# Altium schematic sheet FPGA_POWER.SchDoc
size 420 x 297 mm; SheetNumber: 27; SheetTotal: 34
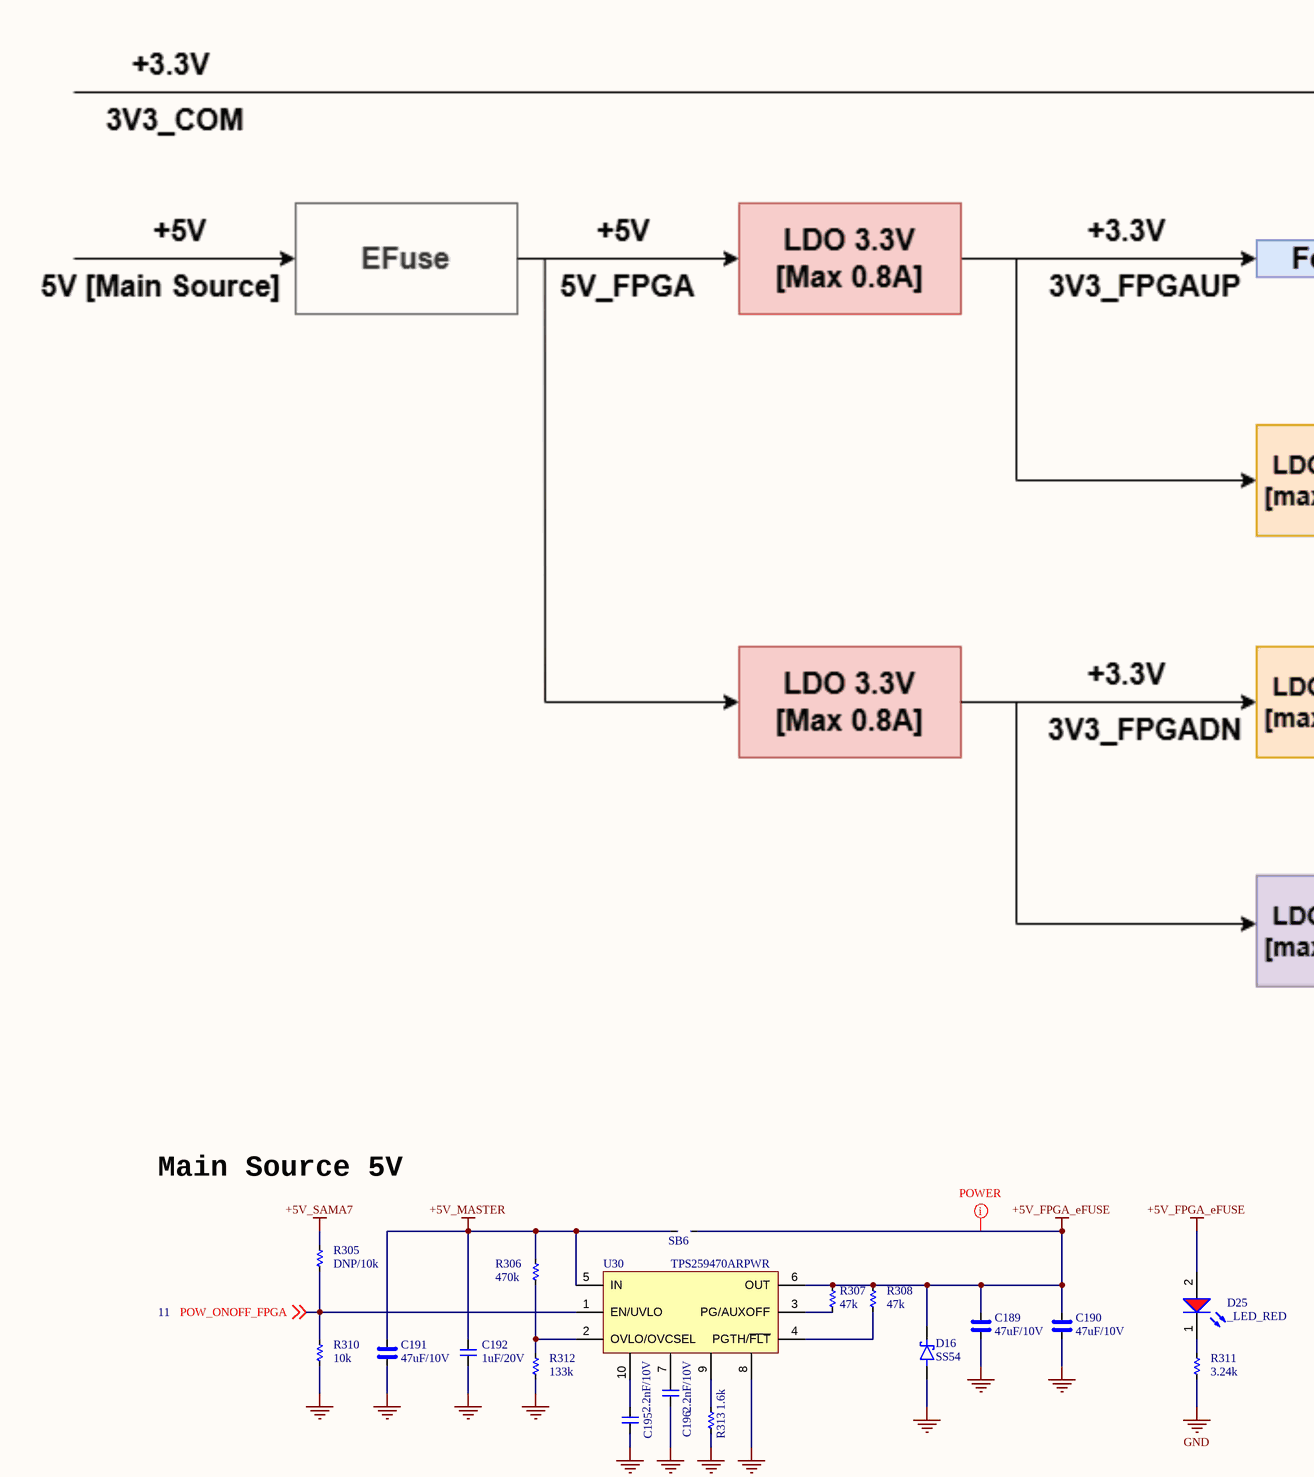
[diagram p0: FPGA_POWER.SchDoc, top left]
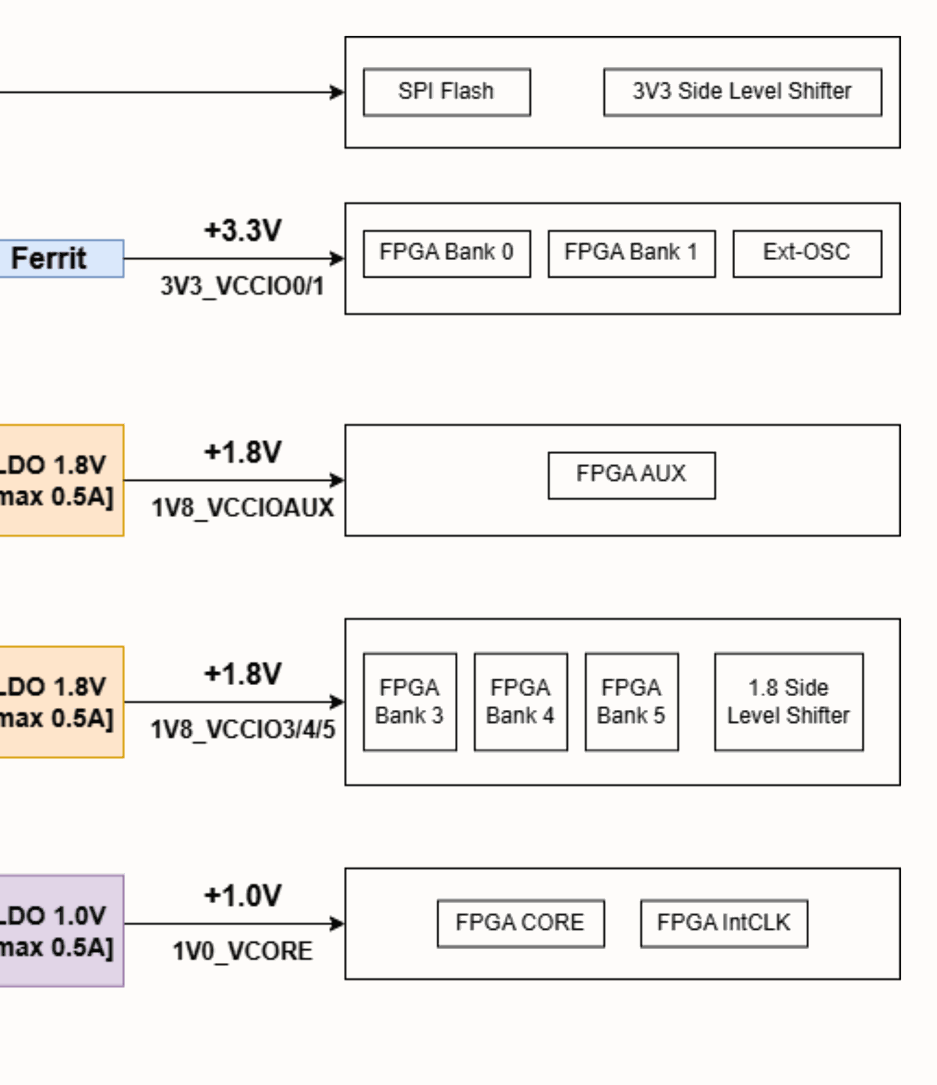
[diagram p1: FPGA_POWER.SchDoc, top right]
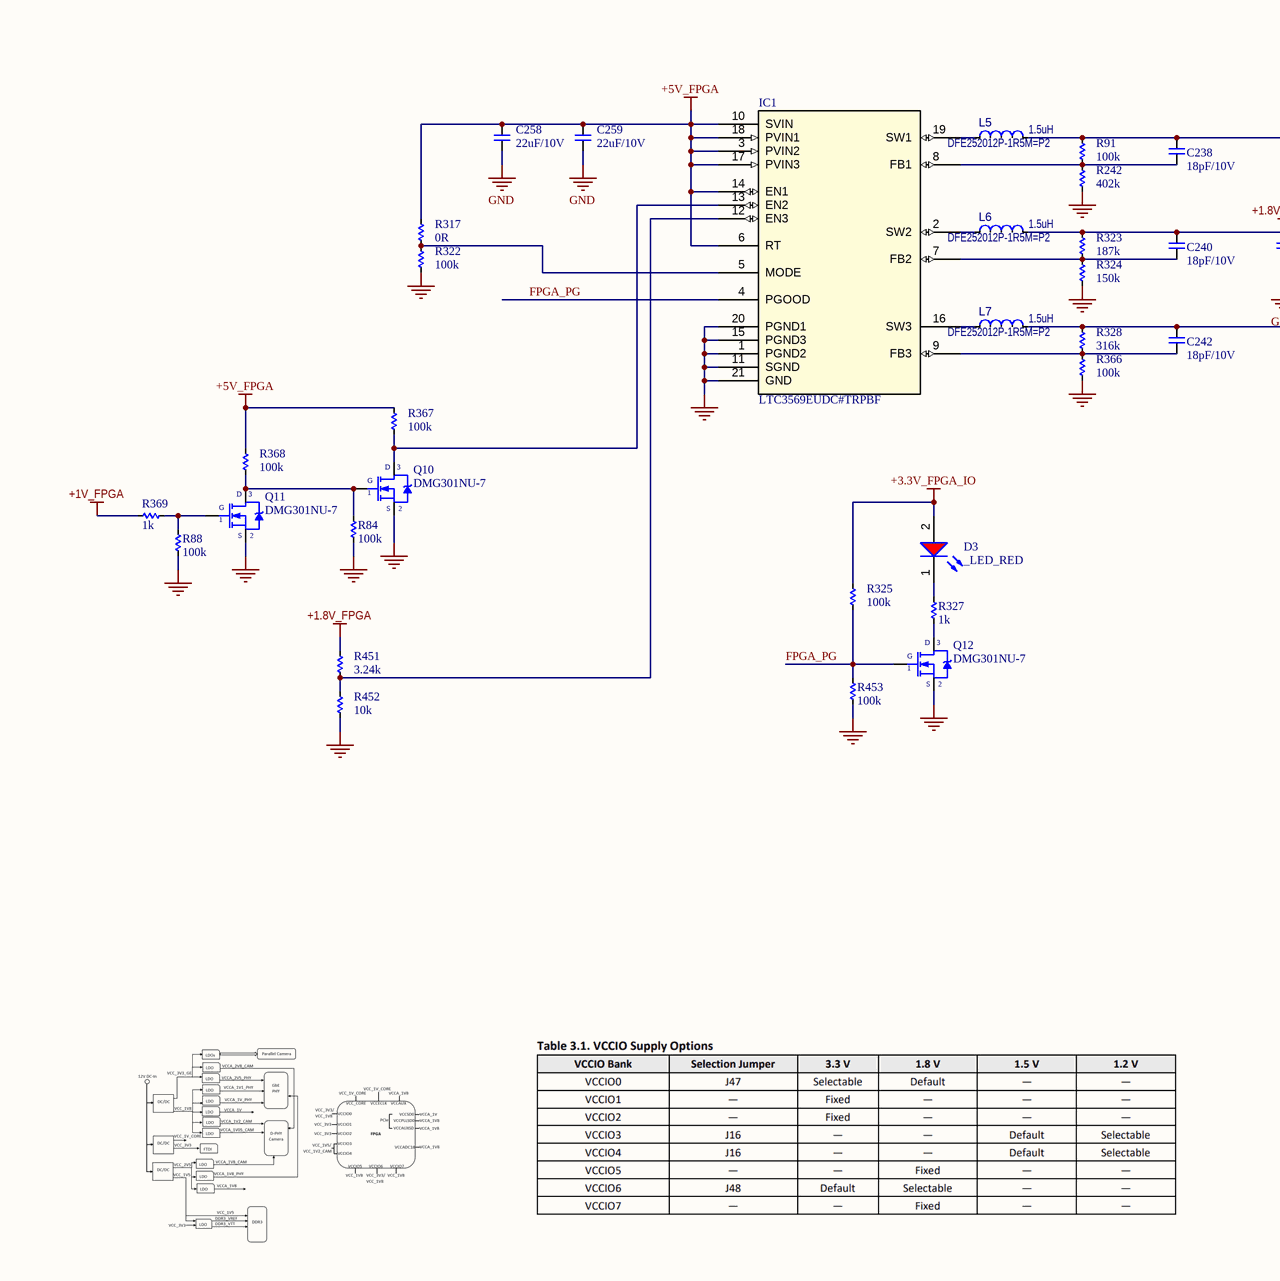
[diagram p2: FPGA_POWER.SchDoc, bottom left]
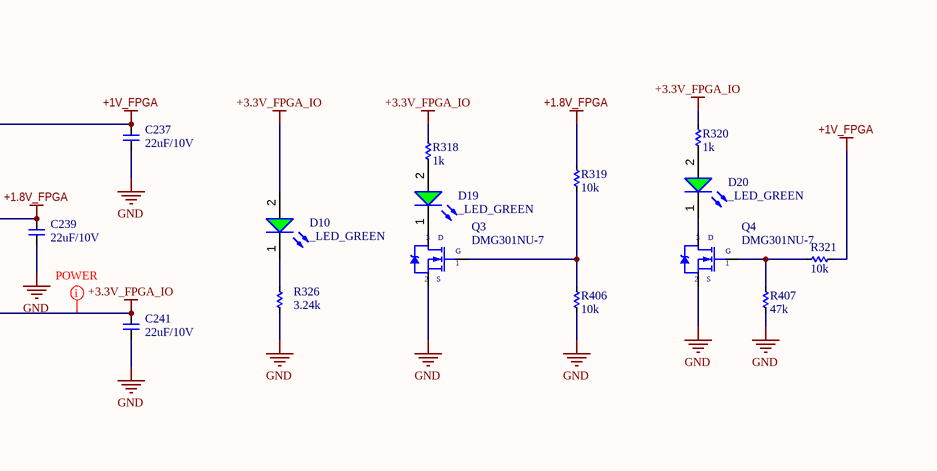
[diagram p3: FPGA_POWER.SchDoc, bottom right]

## Parts
C189  47uF/10V  [CAP_C_3225X80]
C190  47uF/10V  [CAP_C_3225X80]
C191  47uF/10V  [CAP_C_3225X80]
C192  1uF/20V  [CAP_C_1005X50_L]
C195  2.2nF/10V  [CAP_C_1005X50_L]
C196  2.2nF/10V  [CAP_C_1005X50_L]
C237  22uF/10V  [CAP_C_1608X80]
C238  18pF/10V  [CAP_C_1005X50_L]
C239  22uF/10V  [CAP_C_1608X80]
C240  18pF/10V  [CAP_C_1005X50_L]
C241  22uF/10V  [CAP_C_1608X80]
C242  18pF/10V  [CAP_C_1005X50_L]
C258  22uF/10V  [CAP_C_1608X80]
C259  22uF/10V  [CAP_C_1608X80]
D3  _LED_RED  [LED_0603]
D10  _LED_GREEN  [LED_0603]
D16  SS54  [DO-214AC_SMA]
D19  _LED_GREEN  [LED_0603]
D20  _LED_GREEN  [LED_0603]
D25  _LED_RED  [LED_0603]
IC1  LTC3569EUDC#TRPBF  [QFN20_UDC_3X4_ADI]
L5  value 1.5uH  [IND_C_1008]  (hidden comment: DFE252012P-1R5M=P2)
L6  value 1.5uH  [IND_C_1008]  (hidden comment: DFE252012P-1R5M=P2)
L7  value 1.5uH  [IND_C_1008]  (hidden comment: DFE252012P-1R5M=P2)
Q3  DMG301NU-7  [SOT95P240X120-3N]
Q4  DMG301NU-7  [SOT95P240X120-3N]
Q10  DMG301NU-7  [SOT95P240X120-3N]
Q11  DMG301NU-7  [SOT95P240X120-3N]
Q12  DMG301NU-7  [SOT95P240X120-3N]
R84  100k  [RES_C_1005x30_L]
R88  100k  [RES_C_1005x30_L]
R91  100k  [RES_C_1005x30_L]
R242  402k  [RES_C_1005x30_L]
R305  DNP/10k  [RES_C_1005x30_L]
R306  470k  [RES_C_1005x30_L]
R307  47k  [RES_C_1005x30_L]
R308  47k  [RES_C_1005x30_L]
R310  10k  [RES_C_1005x30_L]
R311  3.24k  [RES_C_1005x30_L]
R312  133k  [RES_C_1005x30_L]
R313  1.6k  [RES_C_1005x30_L]
R317  0R  [RES_C_1005x30_L]
R318  1k  [RES_C_1005x30_L]
R319  10k  [RES_C_1005x30_L]
R320  1k  [RES_C_1005x30_L]
R321  10k  [RES_C_1005x30_L]
R322  100k  [RES_C_1005x30_L]
R323  187k  [RES_C_1005x30_L]
R324  150k  [RES_C_1005x30_L]
R325  100k  [RES_C_1005x30_L]
R326  3.24k  [RES_C_1005x30_L]
R327  1k  [RES_C_1005x30_L]
R328  316k  [RES_C_1005x30_L]
R366  100k  [RES_C_1005x30_L]
R367  100k  [RES_C_1005x30_L]
R368  100k  [RES_C_1005x30_L]
R369  1k  [RES_C_1005x30_L]
R406  10k  [RES_C_1005x30_L]
R407  47k  [RES_C_1005x30_L]
R451  3.24k  [RES_C_1005x30_L]
R452  10k  [RES_C_1005x30_L]
R453  100k  [RES_C_1005x30_L]
SB6  JUMPER  [JUMPER_1608]  (value not drawn)
U30  TPS259470ARPWR  [VQFN-HR-10]

## Nets
+1.8V_FPGA: C239.1 C240.1 L6.2(F) R319.1 R323.2 R451.2
+1V_FPGA: C237.1 C238.1 L5.2(F) R91.2 R321.1 R369.2
+3.3V_FPGA_IO: C241.1 C242.1 D3.2(A) D10.2(A) L7.2(F) R318.2 R320.2 R325.2 R328.2
+5V_FPGA: C258.1 C259.1 IC1.3(PVIN2) IC1.6(RT) IC1.10(SVIN) IC1.14(EN1) IC1.17(PVIN3) IC1.18(PVIN1) R317.2 R367.2 R368.2
+5V_FPGA_eFUSE: C189.2 C190.2 D16.1(K) D25.2(A) R307.2 R308.2 SB6.2 U30.6(OUT)
+5V_MASTER: C191.2 C192.2 R306.2 SB6.1 U30.5(IN)
+5V_SAMA7: R305.1
GND: C189.1 C190.1 C191.1 C192.1 C195.1 C196.1 C237.2 C239.2 C241.2 C258.2 C259.2 D16.2(A) IC1.1(PGND2) IC1.11(SGND) IC1.15(PGND3) IC1.20(PGND1) IC1.21(GND) Q3.2(S) Q4.2(S) Q10.2(S) Q11.2(S) Q12.2(S) R84.2 R88.2 R242.1 R310.2 R311.1 R312.1 R313.1 R322.1 R324.1 R326.1 R366.1 R406.2 R407.1 R452.1 R453.2 U30.8
FPGA_PG: IC1.4(PGOOD) Q12.1(G) R325.1 R453.1
POW_ONOFF_FPGA: R305.2 R310.1 U30.1(EN/UVLO) ; off-sheet POW_ONOFF_FPGA
NetC195_2: C195.2 U30.10
NetC196_2: C196.2 U30.7
NetC238_2: C238.2 IC1.8(FB1) R91.1 R242.2
NetC240_2: C240.2 IC1.7(FB2) R323.1 R324.2
NetC242_2: C242.2 IC1.9(FB3) R328.1 R366.2
NetD3_1: D3.1(K) R327.2
NetD10_1: D10.1(K) R326.2
NetD19_1: D19.1(K) Q3.3(D)
NetD19_2: D19.2(A) R318.1
NetD20_1: D20.1(K) Q4.3(D)
NetD20_2: D20.2(A) R320.1
NetD25_1: D25.1(K) R311.2
NetIC1_2: IC1.2(SW2) L6.1(S)
NetIC1_5: IC1.5(MODE) R317.1 R322.2
NetIC1_12: IC1.12(EN3) R451.1 R452.2
NetIC1_13: IC1.13(EN2) Q10.3(D) R367.1
NetIC1_16: IC1.16(SW3) L7.1(S)
NetIC1_19: IC1.19(SW1) L5.1(S)
NetQ3_1: Q3.1(G) R319.2 R406.1
NetQ4_1: Q4.1(G) R321.2 R407.2
NetQ10_1: Q10.1(G) Q11.3(D) R84.1 R368.1
NetQ11_1: Q11.1(G) R88.1 R369.1
NetQ12_3: Q12.3(D) R327.1
NetR306_1: R306.1 R312.2 U30.2(OVLO/OVCSEL)
NetR307_1: R307.1 U30.3(PG/AUXOFF)
NetR308_1: R308.1 U30.4(PGTH/~{FLT})
NetR313_2: R313.2 U30.9

## Layout directives
net class POWER: +3.3V_FPGA_IO, +5V_FPGA_eFUSE

## Notes on the sheet
- Main Source 5V
- Project:
- Sub-system:
- Design by:
- Sheet title:
- Sheet
- of
- Checked by:
- Approved by:
- Revision:
- Document No:
- Size:
- Date:
- A3

## Library data of the parts
C189-C191 = _CAP_C_High_2: CAP CHIP High Value
C192 C195 C196 = _CAP_C_2: CAP CHIP
C237-C242 C258 C259 = _CAP_C_2: CAP
D3 D25 = LED_RED: LED RED CLEAR 0603 SMD
D10 D19 D20 = LED_GREEN: LED GREEN CLEAR 0603 SMD
D16 = DIODE SCHOTTKY
IC1 = LTC3569EUDCTRPBF: Triple Buck Regulator with 1.2A and Two 600mA Outputs and Individual Programmable References; Manufacturer_Name: Analog Devices Inc; Copyright: Copyright (C) 2025 Ultra Librarian. All rights reserved.; Manufacturer_Part_Number: LTC3569EUDC#TRPBF; RefDes: RefDes; Type: Type
L5-L7 = IND1335: Inductor; Manufacturer 1: Murata Electronics North America; Description_: INDUCTOR 1.5uH 3.5A 20% SMD 1008; Dev Tools Status: Design; Owner: Razvan Cristescu; DCR: 0.06R; RMS Current: 3.5A; Test Frequency: 1MHz; Populated: YES; MCHP-ID: IND1335; Revision: A; Symbol: Inductor; Status: MCL Design; ComponentLink1URL: https://chn-vm-apps.microchip.com/mchprepo/parts/Datasheets/m_dfe252012p.pdf; ComponentLink1Description: SVN Datasheet; ComponentLink2URL: C:\ALTIUM_WORK\00001_MCHP-CDB\Datasheets\m_dfe252012p.pdf; ComponentLink2Description: Local Datasheet; ComponentLink3URL: C:\ALTIUM_WORK\00001_MCHP-CDB\Library\LibraryRefs\Inductor.SchLib; ComponentLink3Description: Open Symbol; ComponentLink4URL: C:\ALTIUM_WORK\00001_MCHP-CDB\Library\Footprints\IND_C_1008.PcbLib; ComponentLink4Description: Open Footprint; ComponentLink5Description: Open Footprint 2; ComponentLink6Description: Open Footprint 3; ComponentLink7Description: Open Footprint 4; Package: 1008; Type: Inductor; Category: Inductor; Manufacturer Part Number 1: DFE252012P-1R5M=P2; Supplier 1: Digi-Key; Supplier Part Number 1: 490-10648-6-ND; Quantity Override: 1
Q3 Q4 Q10-Q12 = MOSFET_N_GSD
R84 R88 R91 R242 R305-R308 R310-R313 R317-R328 R366-R369 R406 R407 R451-R453 = _RES_B_2: RES